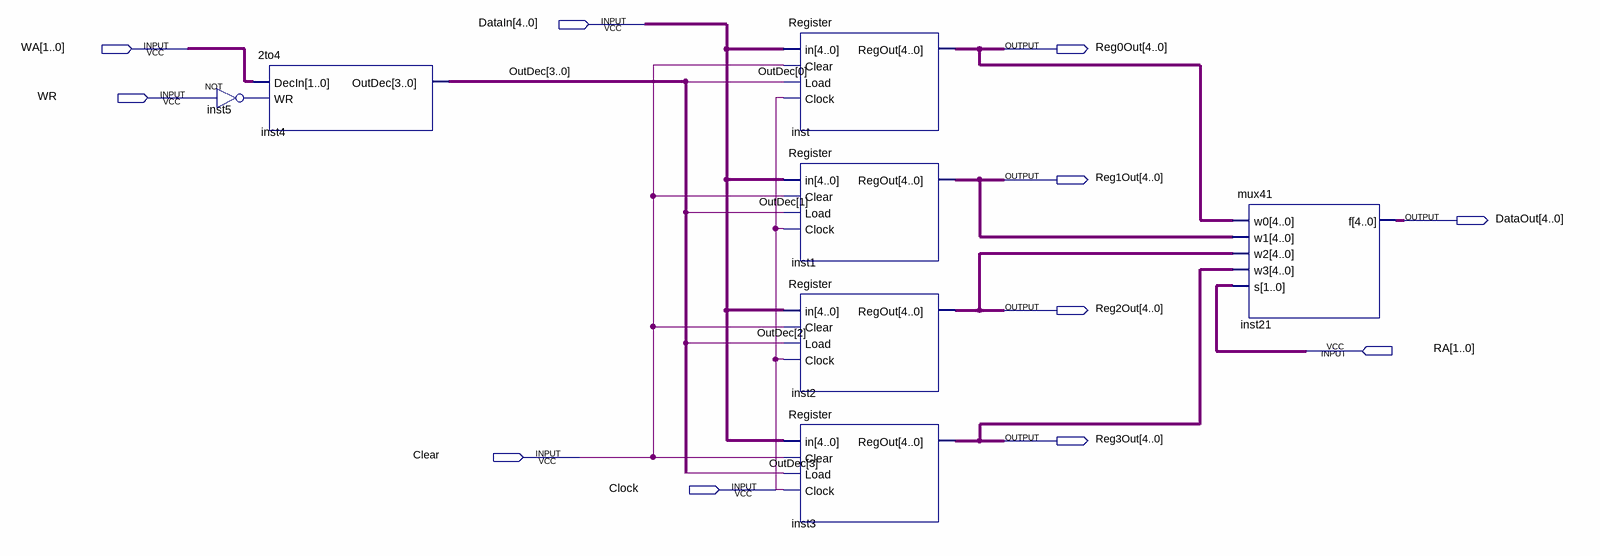
[diagram p0: schematic sheet]
// Quartus schematic RegisterFile.bdf as structural Verilog: 7 symbols, 11 pins
module RegisterFile (
  input  [4:0] DataIn,
  input  [1:0] WA,
  input  WR,
  input  [1:0] RA,
  input  Clear,
  input  Clock,
  output [4:0] Reg0Out,
  output [4:0] Reg1Out,
  output [4:0] DataOut,
  output [4:0] Reg2Out,
  output [4:0] Reg3Out
);

  wire inst5_out;
  wire [3:0] OutDec;

  not inst5 (inst5_out, WR);
  \2to4  inst4 (.DecIn(WA), .WR(inst5_out), .OutDec(OutDec));
  Register inst (.in(DataIn), .Clear(Clear), .Load(OutDec[0]), .Clock(Clock), .RegOut(Reg0Out));
  Register inst1 (.in(DataIn), .Clear(Clear), .Load(OutDec[1]), .Clock(Clock), .RegOut(Reg1Out));
  Register inst2 (.in(DataIn), .Clear(Clear), .Load(OutDec[2]), .Clock(Clock), .RegOut(Reg2Out));
  Register inst3 (.in(DataIn), .Clear(Clear), .Load(OutDec[3]), .Clock(Clock), .RegOut(Reg3Out));
  mux41 inst21 (.w0(Reg0Out), .w1(Reg1Out), .w2(Reg2Out), .w3(Reg3Out), .s(RA), .f(DataOut));
endmodule
